# Altium schematic sheet 02-FPGA_IO_MIPI_TS.SchDoc: FPGA IO, MIPI, Touchscreen
size A3; DrawnBy: Rain Adelbert; Revision: 1.2; SheetNumber: 2; SheetTotal: 9; ProjectName: AsicVault PSD
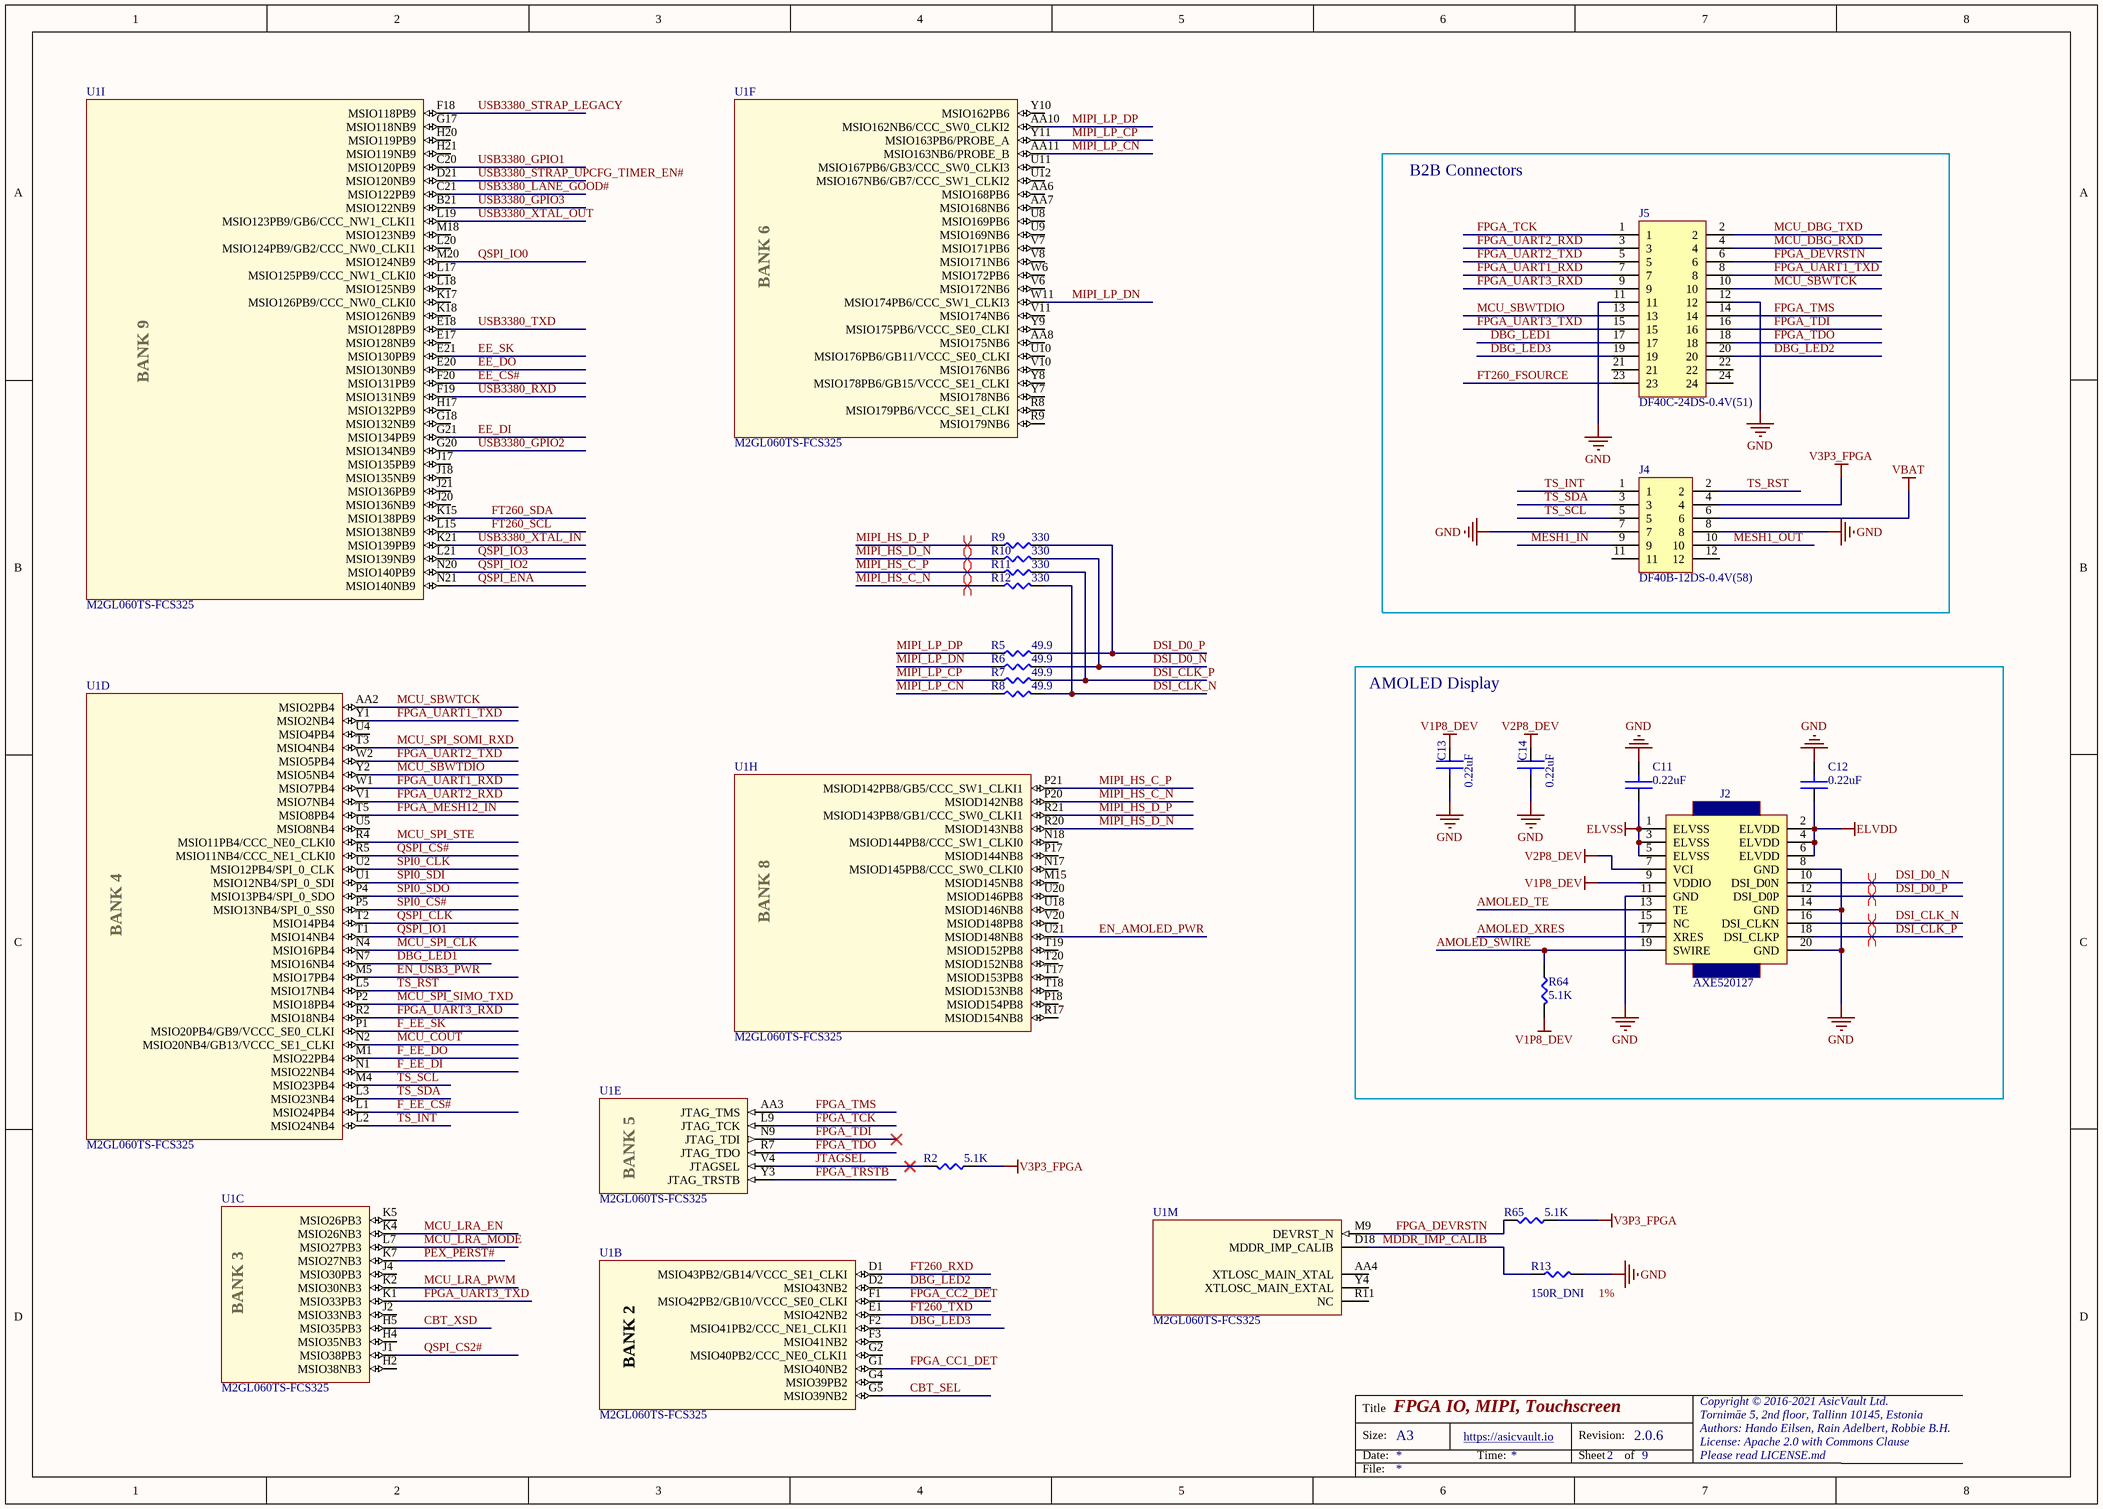
[diagram p0: 02-FPGA_IO_MIPI_TS.SchDoc]

## Parts
C11  0.22uF  [C0201]
C12  0.22uF  [C0201]
C13  0.22uF  [C0201]
C14  0.22uF  [C0201]
J2  AXE520127  [AXE520127]
J4  DF40B-12DS-0.4V(58)  [DF40B-12DS]
J5  DF40C-24DS-0.4V(51)  [DF40C-24DS]
R2  5.1K  [R0201]
R5  49.9  [R0201]
R6  49.9  [R0201]
R7  49.9  [R0201]
R8  49.9  [R0201]
R9  330  [R0201]
R10  330  [R0201]
R11  330  [R0201]
R12  330  [R0201]
R13  150R_DNI  [R0201]
R64  5.1K  [R0201]
R65  5.1K  [R0201]
U1  M2GL060TS-FCS325  [FCS325-OPT1]  (parts B,C,D,E,F,H,I,M of 16)

## Blocks framed on the sheet
B2B Connectors: J4 J5
AMOLED Display: C11-C14 J2 R64

## Nets
ELVDD: C12.1 J2.2(ELVDD) J2.4(ELVDD) J2.6(ELVDD)
ELVSS: C11.1 J2.1(ELVSS) J2.3(ELVSS) J2.5(ELVSS)
GND: C11.2 C12.2 C13.2 C14.2 J2.8(GND) J2.11(GND) J2.14(GND) J2.20(GND) J4.7 J4.8 J5.11 J5.12 R13.2
V1P8_DEV: C13.1 J2.9(VDDIO) R64.2
V2P8_DEV: C14.1 J2.7(VCI)
V3P3_FPGA: J4.4 R2.1 R65.1
VBAT: J4.6
AMOLED_SWIRE: J2.19(SWIRE) R64.1
AMOLED_TE: J2.13(TE)
AMOLED_XRES: J2.17(XRES)
CBT_SEL: U1.G5(MSIO39NB2)
CBT_XSD: U1.H5(MSIO35PB3)
DBG_LED1: J5.17 U1.N7(MSIO16NB4)
DBG_LED2: J5.20 U1.D2(MSIO43NB2)
DBG_LED3: J5.19 U1.F2(MSIO41PB2/CCC_NE1_CLKI1)
DSI_CLK_N: J2.16(DSI_CLKN) R8.2 R12.2
DSI_CLK_P: J2.18(DSI_CLKP) R7.2 R11.2
DSI_D0_N: J2.10(DSI_D0N) R6.2 R10.2
DSI_D0_P: J2.12(DSI_D0P) R5.2 R9.2
EE_CS#: U1.F20(MSIO131PB9)
EE_DI: U1.G21(MSIO134PB9)
EE_DO: U1.E20(MSIO130NB9)
EE_SK: U1.E21(MSIO130PB9)
EN_AMOLED_PWR: U1.U21(MSIOD148NB8)
EN_USB3_PWR: U1.M5(MSIO17PB4)
F_EE_CS#: U1.L1(MSIO24PB4)
F_EE_DI: U1.N1(MSIO22NB4)
F_EE_DO: U1.M1(MSIO22PB4)
F_EE_SK: U1.P1(MSIO20PB4/GB9/VCCC_SE0_CLKI)
FPGA_CC1_DET: U1.G1(MSIO40NB2)
FPGA_CC2_DET: U1.F1(MSIO42PB2/GB10/VCCC_SE0_CLKI)
FPGA_DEVRSTN: J5.6 R65.2 U1.M9(DEVRST_N)
FPGA_MESH12_IN: U1.T5(MSIO8PB4)
FPGA_TCK: J5.1 U1.L9(JTAG_TCK)
FPGA_TDI: J5.16 U1.N9(JTAG_TDI)
FPGA_TDO: J5.18 U1.R7(JTAG_TDO)
FPGA_TMS: J5.14 U1.AA3(JTAG_TMS)
FPGA_TRSTB: U1.Y3(JTAG_TRSTB)
FPGA_UART1_RXD: J5.7 U1.W1(MSIO7PB4)
FPGA_UART1_TXD: J5.8 U1.Y1(MSIO2NB4)
FPGA_UART2_RXD: J5.3 U1.V1(MSIO7NB4)
FPGA_UART2_TXD: J5.5 U1.W2(MSIO5PB4)
FPGA_UART3_RXD: J5.9 U1.R2(MSIO18NB4)
FPGA_UART3_TXD: J5.15 U1.K1(MSIO33PB3)
FT260_FSOURCE: J5.23
FT260_RXD: U1.D1(MSIO43PB2/GB14/VCCC_SE1_CLKI)
FT260_SCL: U1.L15(MSIO138NB9)
FT260_SDA: U1.K15(MSIO138PB9)
FT260_TXD: U1.E1(MSIO42NB2)
JTAGSEL: R2.2 U1.V4(JTAGSEL)
MCU_COUT: U1.N2(MSIO20NB4/GB13/VCCC_SE1_CLKI)
MCU_DBG_RXD: J5.4
MCU_DBG_TXD: J5.2
MCU_LRA_EN: U1.K4(MSIO26NB3)
MCU_LRA_MODE: U1.L7(MSIO27PB3)
MCU_LRA_PWM: U1.K2(MSIO30NB3)
MCU_SBWTCK: J5.10 U1.AA2(MSIO2PB4)
MCU_SBWTDIO: J5.13 U1.Y2(MSIO5NB4)
MCU_SPI_CLK: U1.N4(MSIO16PB4)
MCU_SPI_SIMO_TXD: U1.P2(MSIO18PB4)
MCU_SPI_SOMI_RXD: U1.T3(MSIO4NB4)
MCU_SPI_STE: U1.R4(MSIO11PB4/CCC_NE0_CLKI0)
MDDR_IMP_CALIB: R13.1 U1.D18(MDDR_IMP_CALIB)
MESH1_IN: J4.9
MESH1_OUT: J4.10
MIPI_HS_C_N: R12.1 U1.P20(MSIOD142NB8)
MIPI_HS_C_P: R11.1 U1.P21(MSIOD142PB8/GB5/CCC_SW1_CLKI1)
MIPI_HS_D_N: R10.1 U1.R20(MSIOD143NB8)
MIPI_HS_D_P: R9.1 U1.R21(MSIOD143PB8/GB1/CCC_SW0_CLKI1)
MIPI_LP_CN: R8.1 U1.AA11(MSIO163NB6/PROBE_B)
MIPI_LP_CP: R7.1 U1.Y11(MSIO163PB6/PROBE_A)
MIPI_LP_DN: R6.1 U1.W11(MSIO174PB6/CCC_SW1_CLKI3)
MIPI_LP_DP: R5.1 U1.AA10(MSIO162NB6/CCC_SW0_CLKI2)
PEX_PERST#: U1.K7(MSIO27NB3)
QSPI_CLK: U1.T2(MSIO14PB4)
QSPI_CS2#: U1.J1(MSIO38PB3)
QSPI_CS#: U1.R5(MSIO11NB4/CCC_NE1_CLKI0)
QSPI_ENA: U1.N21(MSIO140NB9)
QSPI_IO0: U1.M20(MSIO124NB9)
QSPI_IO1: U1.T1(MSIO14NB4)
QSPI_IO2: U1.N20(MSIO140PB9)
QSPI_IO3: U1.L21(MSIO139NB9)
SPI0_CLK: U1.U2(MSIO12PB4/SPI_0_CLK)
SPI0_CS#: U1.P5(MSIO13NB4/SPI_0_SS0)
SPI0_SDI: U1.U1(MSIO12NB4/SPI_0_SDI)
SPI0_SDO: U1.P4(MSIO13PB4/SPI_0_SDO)
TS_INT: J4.1 U1.L2(MSIO24NB4)
TS_RST: J4.2 U1.L5(MSIO17NB4)
TS_SCL: J4.5 U1.M4(MSIO23PB4)
TS_SDA: J4.3 U1.L3(MSIO23NB4)
USB3380_GPIO1: U1.C20(MSIO120PB9)
USB3380_GPIO2: U1.G20(MSIO134NB9)
USB3380_GPIO3: U1.B21(MSIO122NB9)
USB3380_LANE_GOOD#: U1.C21(MSIO122PB9)
USB3380_RXD: U1.F19(MSIO131NB9)
USB3380_STRAP_LEGACY: U1.F18(MSIO118PB9)
USB3380_STRAP_UPCFG_TIMER_EN#: U1.D21(MSIO120NB9)
USB3380_TXD: U1.E18(MSIO128PB9)
USB3380_XTAL_IN: U1.K21(MSIO139PB9)
USB3380_XTAL_OUT: U1.L19(MSIO123PB9/GB6/CCC_NW1_CLKI1)

Not connected (* = marked no-connect by the designer): J2 15(NC); J4 11 12; J5 21 22 24; U1 AA4(XTLOSC_MAIN_XTAL) AA6(MSIO168PB6) AA7(MSIO168NB6) AA8(MSIO175NB6) E17(MSIO128NB9) F3(MSIO41NB2) G2(MSIO40PB2/CCC_NE0_CLKI1) G4(MSIO39PB2) G17(MSIO118NB9) G18(MSIO132NB9) H2(MSIO38NB3) H4(MSIO35NB3) H17(MSIO132PB9) H20(MSIO119PB9) H21(MSIO119NB9) J2(MSIO33NB3) J4(MSIO30PB3) J17(MSIO135PB9) J18(MSIO135NB9) J20(MSIO136NB9) J21(MSIO136PB9) K5(MSIO26PB3) K17(MSIO126PB9/CCC_NW0_CLKI0) K18(MSIO126NB9) L17(MSIO125PB9/CCC_NW1_CLKI0) L18(MSIO125NB9) L20(MSIO124PB9/GB2/CCC_NW0_CLKI1) M15(MSIOD145NB8) M18(MSIO123NB9) N17(MSIOD145PB8/CCC_SW0_CLKI0) N18(MSIOD144PB8/CCC_SW1_CLKI0) P17(MSIOD144NB8) P18(MSIOD154PB8) R8(MSIO179PB6/VCCC_SE1_CLKI) R9(MSIO179NB6) R11(NC) R17(MSIOD154NB8) T17(MSIOD153PB8) T18(MSIOD153NB8) T19(MSIOD152PB8) T20(MSIOD152NB8) U4(MSIO4PB4) U5(MSIO8NB4) U8(MSIO169PB6) U9(MSIO169NB6) U10(MSIO176PB6/GB11/VCCC_SE0_CLKI) U11(MSIO167PB6/GB3/CCC_SW0_CLKI3) U12(MSIO167NB6/GB7/CCC_SW1_CLKI2) U18(MSIOD146NB8) U20(MSIOD146PB8) V6(MSIO172NB6) V7(MSIO171PB6) V8(MSIO171NB6) V10(MSIO176NB6) V11(MSIO174NB6) V20(MSIOD148PB8) W6(MSIO172PB6) Y4(XTLOSC_MAIN_EXTAL) Y7(MSIO178NB6) Y8(MSIO178PB6/GB15/VCCC_SE1_CLKI) Y9(MSIO175PB6/VCCC_SE0_CLKI) Y10(MSIO162PB6)

## Layout directives
differential pair: DSI_CLK_N, DSI_CLK_P, DSI_D0_N, DSI_D0_P, MIPI_HS_C_N, MIPI_HS_C_P, MIPI_HS_D_N, MIPI_HS_D_P

## Notes on the sheet
- (near R13) 1%
- Title
- Size:
- Date:
- A3
- https://asicvault.io
- Time:
- Revision:
- Sheet
- of
- 2.0.6
- Copyright © 2016-2021 AsicVault Ltd.
- Tornimäe 5, 2nd floor, Tallinn 10145, Estonia
- Authors: Hando Eilsen, Rain Adelbert, Robbie B.H.
- License: Apache 2.0 with Commons Clause
- Please read LICENSE.md
- File:
- (in symbol M2GL060TS-FCS325, part B) BANK 2
- (in symbol M2GL060TS-FCS325, part C) BANK 3
- (in symbol M2GL060TS-FCS325, part D) BANK 4
- (in symbol M2GL060TS-FCS325, part E) BANK 5
- (in symbol M2GL060TS-FCS325, part F) BANK 6
- (in symbol M2GL060TS-FCS325, part H) BANK 8
- (in symbol M2GL060TS-FCS325, part I) BANK 9

## Library data of the parts
C11-C14 = 0.22uF/0201: Description 1: CAP CER 0.22UF 6.3V X7S 0201; Supplier 1: Digi-Key; Supplier Part Number 1: 445-9075-1-ND
J2 = AXE520127: Description 1: 20 Position Connector Socket, Center Strip Contacts Surface Mount Gold; Supplier 1: Digikey; Supplier Part Number 1: AXE520127-ND
J4 = DF40B-12DS-0.4V(58): Description 1: CONN RCPT 12POS 0.4MM SMD GOLD; Supplier 1: Digi-Key; Supplier Part Number 1: H124596CT-ND
J5 = DF40C-24DS-0.4V(51): Description 1: CONN RCPT 24POS 0.4MM SMD GOLD; Supplier 1: Digi-Key; Supplier Part Number 1: H11621CT-ND
R2 R64 R65 = 5.1K/1%/0201: Description 1: RES SMD 5.1K OHM 1% 1/20W 0201; Supplier 1: Digi-Key; Supplier Part Number 1: YAG2741CT-ND
R5-R8 = 49.9/1%/0201: Description 1: RES SMD 49.9 OHM 1% 1/20W 0201; Supplier 1: Digi-Key; Supplier Part Number 1: YAG2702CT-ND
R9-R12 = 330/1%/0201: Description 1: RES SMD 330 OHM 1% 1/20W 0201; Supplier 1: Digi-Key; Supplier Part Number 1: YAG2604CT-ND
R13 = 150R/1%/0201: Description 1: RES SMD 150 OHM 1% 1/20W 0201; Supplier 1: Digi-Key; Supplier Part Number 1: YAG2273CT-ND
U1 = M2GL060TS-FCS325: Description 1: IC FPGA 200 I/O 325FCBGA; Supplier 1: Digi-Key; Supplier Part Number 1: M2GL060TS-FCS325-ND